# EAGLE design MXC_1_0 (EAGLE 8.3.2)
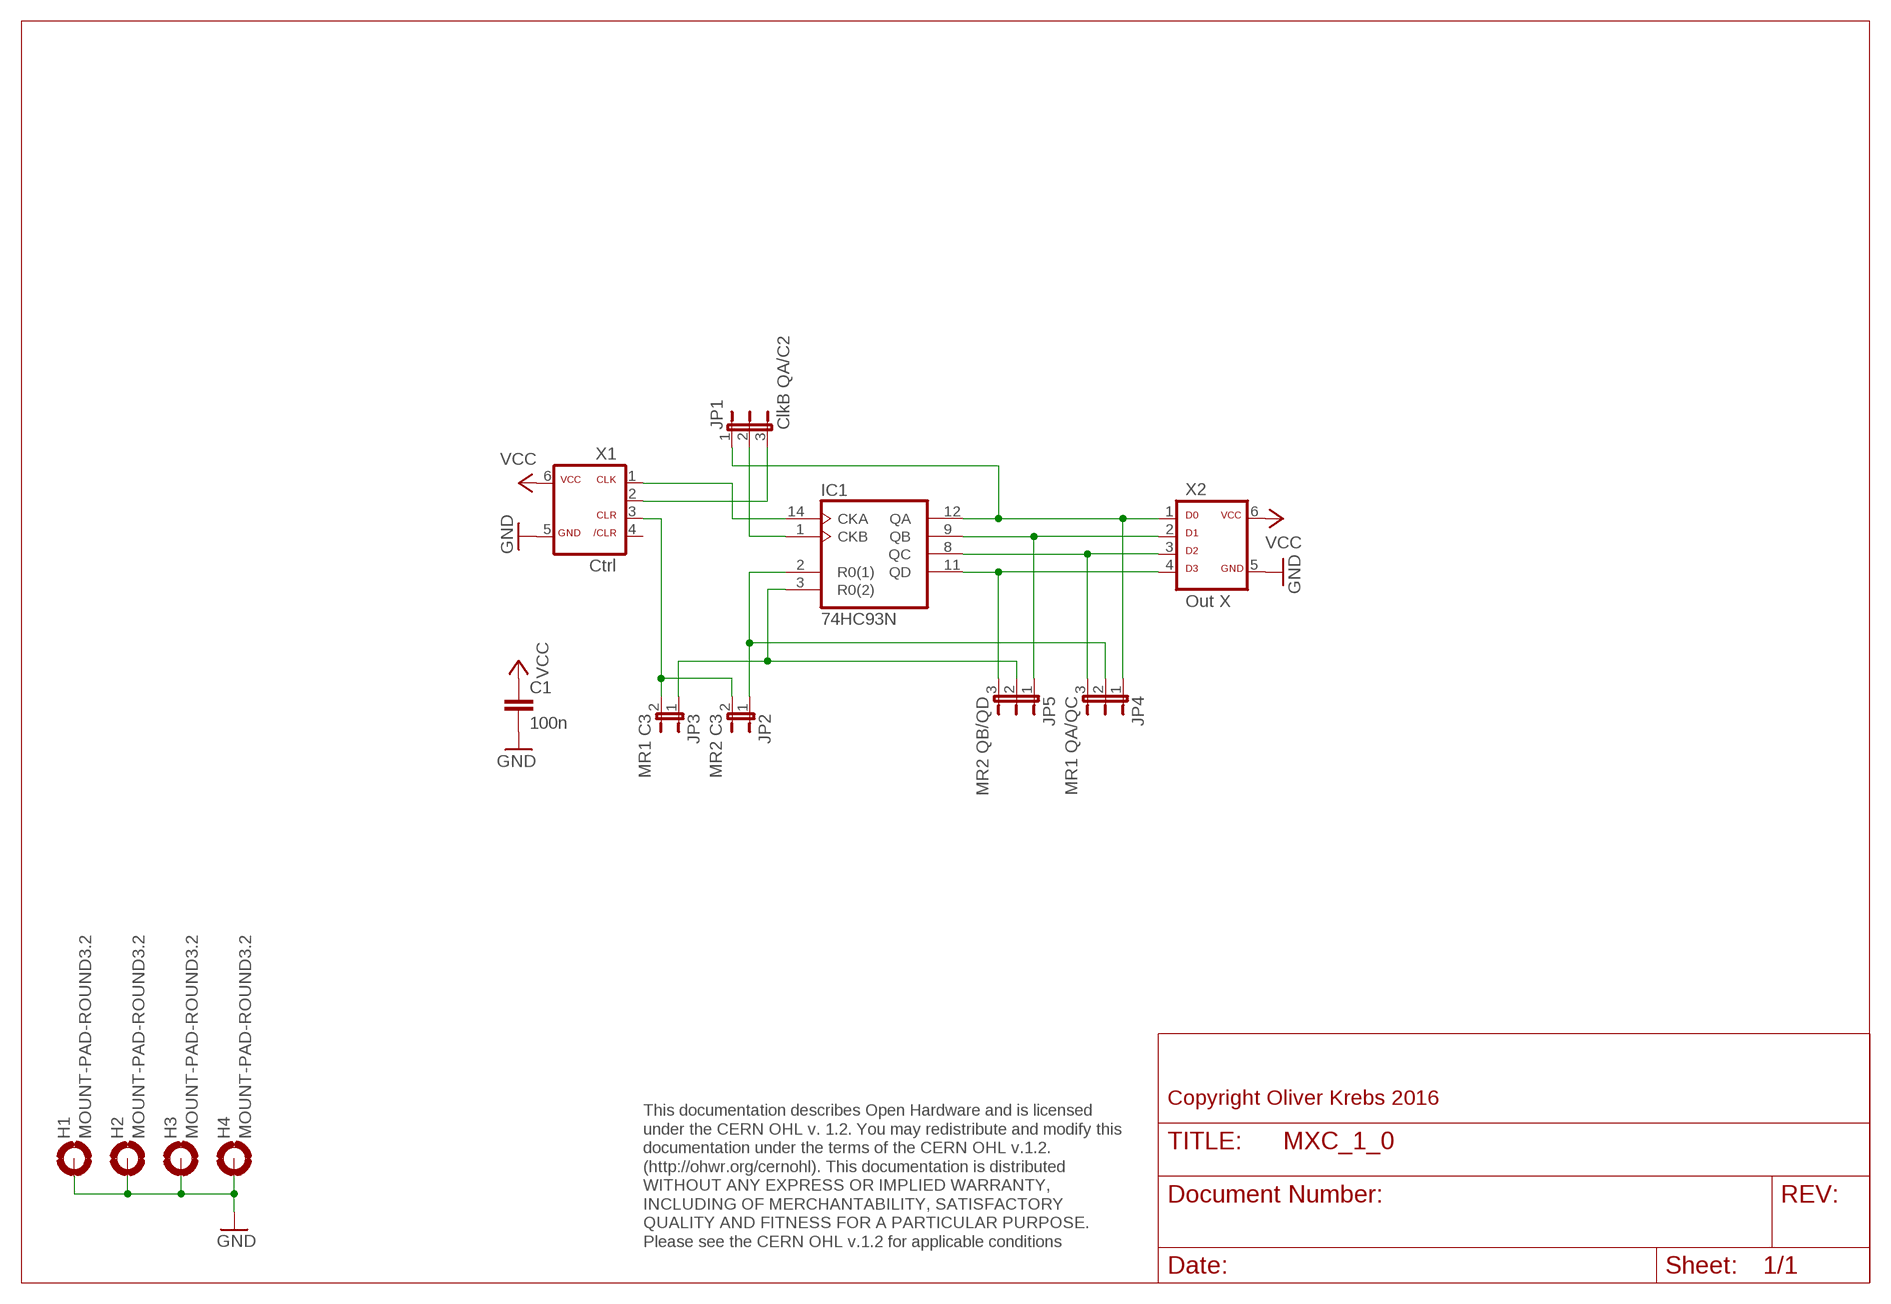
[diagram p0: schematic, sheet 1]

## Parts
C1  100n  C-EU050-025X075  [C050-025X075]
H1  MOUNT-PAD-ROUND3.2  [3,2-PAD]
H2  MOUNT-PAD-ROUND3.2  [3,2-PAD]
H3  MOUNT-PAD-ROUND3.2  [3,2-PAD]
H4  MOUNT-PAD-ROUND3.2  [3,2-PAD]
IC1  74HC93N  [DIL14]
JP1  ClkB QA/C2  JP2EJP2-U  [JP2-U]
JP2  MR2 C3  JP1E  [JP1]
JP3  MR1 C3  JP1E  [JP1]
JP4  MR1 QA/QC  JP2EJP2-U  [JP2-U]
JP5  MR2 QB/QD  JP2EJP2-U  [JP2-U]
X1  Ctrl  ML6C  [ML-6]
X2  Out X  ML6D  [ML-6]

## Nets
GND: C1.2 H1.B3,2(MOUNT) H2.B3,2(MOUNT) H3.B3,2(MOUNT) H4.B3,2(MOUNT) X1.5 X2.5
N$1: IC1.14(CKA) X1.1
N$2: IC1.1(CKB) JP1.2
N$4: IC1.12(QA) JP1.1 JP4.1 X2.1
N$5: IC1.2(R0(1)) JP2.1 JP4.2
N$6: IC1.9(QB) JP5.1 X2.2
N$7: IC1.8(QC) JP4.3 X2.3
N$8: IC1.11(QD) JP5.3 X2.4
N$9: IC1.3(R0(2)) JP3.1 JP5.2
N$10: JP1.3 X1.2
N$11: JP2.2 JP3.2 X1.3
VCC: C1.1 X1.6 X2.6
Unconnected: X1.4

## Notes on the sheet
- Copyright Oliver Krebs 2016
- This documentation describes Open Hardware and is licensed 
  under the CERN OHL v. 1.2. You may redistribute and modify this 
  documentation under the terms of the CERN OHL v.1.2. 
  (http://ohwr.org/cernohl). This documentation is distributed
  WITHOUT ANY EXPRESS OR IMPLIED WARRANTY, 
  INCLUDING OF MERCHANTABILITY, SATISFACTORY 
  QUALITY AND FITNESS FOR A PARTICULAR PURPOSE. 
  Please see the CERN OHL v.1.2 for applicable conditions

## Power pins joined to a net without a drawn wire
GND: IC1.10(GND)
VCC: IC1.5(VCC)

## Library data of the parts
C1 = 01-my_rcl:C-EU: CAPACITOR, European symbol
H1-H4 = holes:MOUNT-PAD-ROUND: MOUNTING PAD, round
IC1 = 74xx-eu:74*93: Decade, divide by twelve and binary COUNTER
JP1 JP4 JP5 = 01-my-jumper:JP2E: JUMPER
JP2 JP3 = 01-my-jumper:JP1E: JUMPER
X1 = 01-my-con:ML6C
X2 = 01-my-con:ML6D

## Board
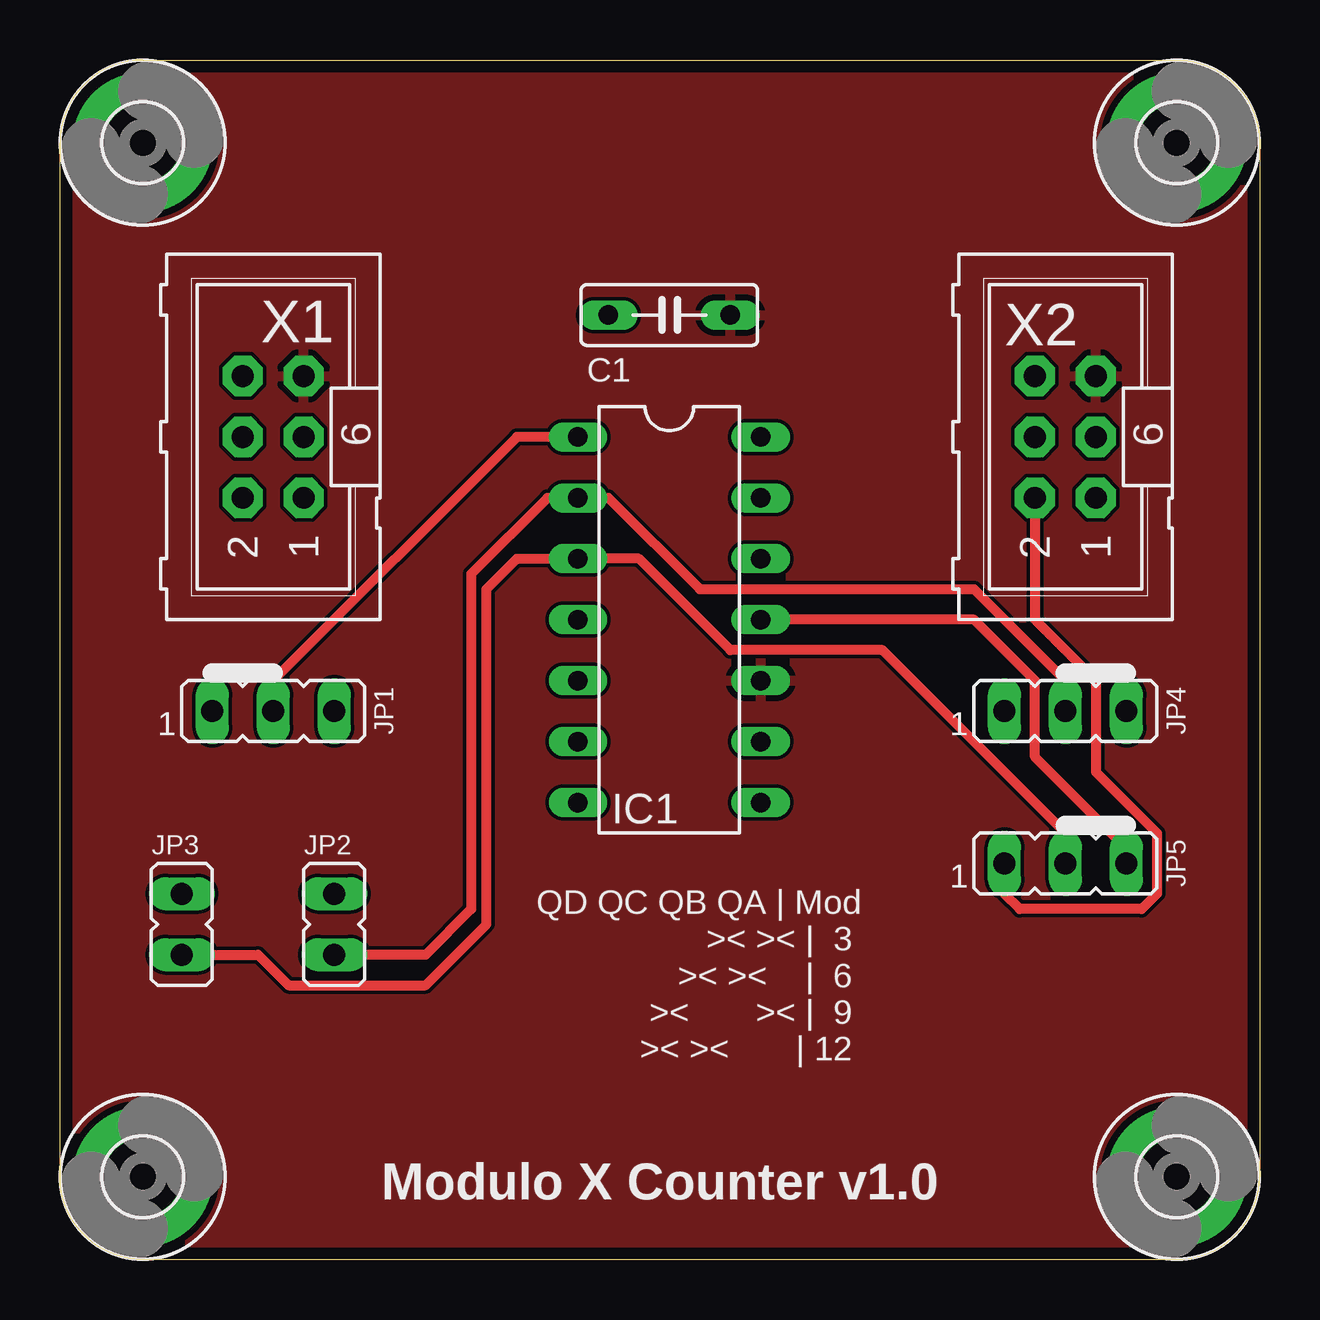
[diagram p1: board, top side]
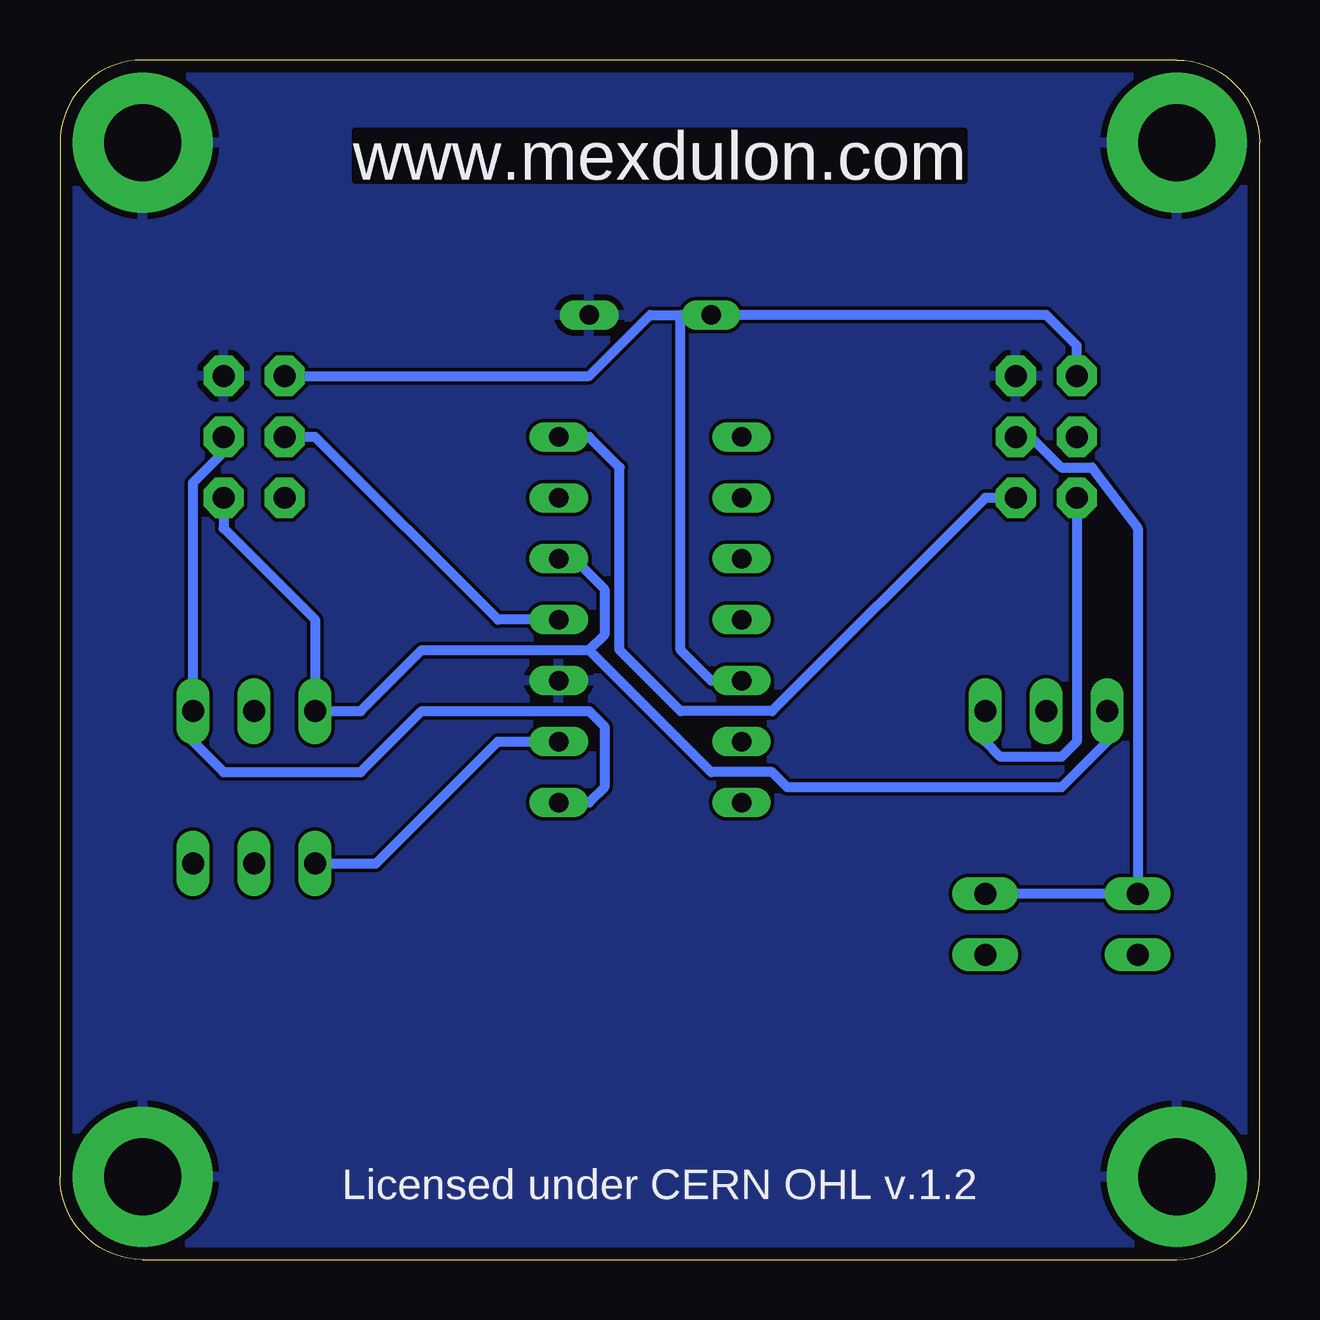
[diagram p2: board, bottom side, seen from below]

Size 50 x 50 mm. Coordinates in mm from the lower left corner, seen from the top.
Outline: 0,3.45 0,46.55 arc-90 3.45,50 46.55,50 arc-90 50,46.55 50,3.45 arc-90 46.55,0 3.45,0 arc-90 0,3.45
Copper layers (1*16): Top 0.035mm / dielectric 1.6mm / Bottom 0.035mm
Design rules "Elecrow_2-layer_PCB_eagle_rule": minimum track width 6mil, minimum drill 12mil, track to track 6mil, track to pad 6mil, pad to pad 6mil, via to via 8mil, smd to smd 0mil, copper to edge 20mil, drill to drill 10mil, minimum pad ring 6mil, minimum via ring 6mil, stop-mask expansion 0mil, vias tented up to drill 100mil, thermal gap 10mil

### Footprints (pad centres in the part's own frame; a part is rotated, then mirrored left to right if it is on the bottom)
C050-025X075 = drill 0.813 long: 1 -2.54,0; 2 2.54,0
3,2-PAD = drill 3.2 pad 5.842: B3,2 0,0
DIL14 = drill 0.813 long: 1 -7.62,-3.81; 2 -5.08,-3.81; 3 -2.54,-3.81; 4 0,-3.81; 5 2.54,-3.81; 6 5.08,-3.81; 7 7.62,-3.81; 8 7.62,3.81; 9 5.08,3.81; 10 2.54,3.81; 11 0,3.81; 12 -2.54,3.81; 13 -5.08,3.81; 14 -7.62,3.81
JP2-U = drill 0.914 long: 1 -2.54,0; 2 0,0; 3 2.54,0
JP1 = drill 0.914 long: 1 0,-1.27; 2 0,1.27
ML-6 = drill 0.914 pad 1.676 octagon: 1 -2.54,-1.27; 2 -2.54,1.27; 3 0,-1.27; 4 0,1.27; 5 2.54,-1.27; 6 2.54,1.27

### Placement (x,y rotation side)
C1  25.4,39.37 0 top
H1  3.45,3.45 0 top
H2  3.45,46.55 0 top
H3  46.55,3.45 0 top
H4  46.55,46.55 0 top
IC1  25.4,26.67 270 top
JP1  8.89,22.86 0 top
JP2  11.43,13.97 0 top
JP3  5.08,13.97 0 top
JP4  41.91,22.86 0 top
JP5  41.91,16.51 0 top
X1  8.89,34.29 90 top
X2  41.91,34.29 90 top

### Tracks (layer width: path | path; a pad name or v marks a point on that pad's centre or on a via)
GND
  pour Bottom: 0,0 50.8,0 50.8,50.8 0,50.8
  pour Top: 0,50.16 50.16,50.16 50.16,0 0,0
N$1
  Bottom 0.406: X1.1 11.43,31.75 20.32,22.86 24.13,22.86 26.67,25.4 26.67,33.02 27.94,34.29 IC1.14
N$2
  Top 0.406: IC1.1 19.05,34.29 8.89,24.13 JP1.2
N$4
  Bottom 0.406: JP1.1 6.35,21.59 8.26,19.68 19.68,19.68 20.32,20.32 22.86,20.32 27.94,25.4 | 27.94,25.4 34.92,25.4 37.47,22.86 JP4.1 39.37,26.67 43.18,30.48 X2.1 | IC1.12 28.57,29.21 27.3,27.94 27.3,26.04 27.94,25.4
N$5
  Top 0.406: JP4.2 41.91,24.13 38.1,27.94 26.67,27.94 22.86,31.75 IC1.2 20.32,31.75 17.14,28.57 17.14,14.61 15.24,12.7 JP2.1
N$6
  Top 0.406: X2.2 40.64,26.67 43.18,24.13 43.18,20.32 45.72,17.78 45.72,15.24 45.09,14.61 40.01,14.61 39.37,15.24 JP5.1
  Bottom 0.406: JP5.1 36.83,16.51 31.75,21.59 IC1.9
N$7
  Bottom 0.406: IC1.8 27.94,19.05 27.3,19.68 27.3,22.23 27.94,22.86 34.92,22.86 37.47,20.32 43.18,20.32 44.45,21.59 JP4.3 44.45,32.38 43.18,33.66 X2.3
N$8
  Top 0.406: JP5.3 44.45,17.14 40.64,20.95 40.64,24.13 38.1,26.67 IC1.11
  Bottom 0.406: IC1.11 31.75,26.67 39.37,34.29 X2.4
N$9
  Top 0.406: JP3.1 8.26,12.7 9.53,11.43 15.24,11.43 17.78,13.97 17.78,27.94 19.05,29.21 IC1.3 24.13,29.21 27.94,25.4 34.29,25.4 41.91,17.78 JP5.2
N$10
  Bottom 0.406: X1.2 7.62,21.59 8.26,20.95 10.79,20.95 11.43,21.59 JP1.3
N$11
  Bottom 0.406: JP2.2 JP3.2 5.08,30.48 6.99,33.02 8.26,33.02 9.53,34.29 X1.3
VCC
  Bottom 0.406: X2.6 27.94,36.83 25.4,39.37 24.13,39.37 | 24.13,39.37 C1.1 8.89,39.37 7.62,38.1 X1.6 | IC1.5 22.86,24.13 24.13,25.4 24.13,39.37

### Text on the board
Bottom: www.mexdulon.com
tNames: QD QC QB QA | Mod / >< >< | 3 / >< >< | 6 / >< >< | 9 / >< >< | 12 | Modulo X Counter v1.0
bNames: www.mexdulon.com | Licensed under CERN OHL v.1.2